# Altium schematic sheet main.SchDoc
size A2
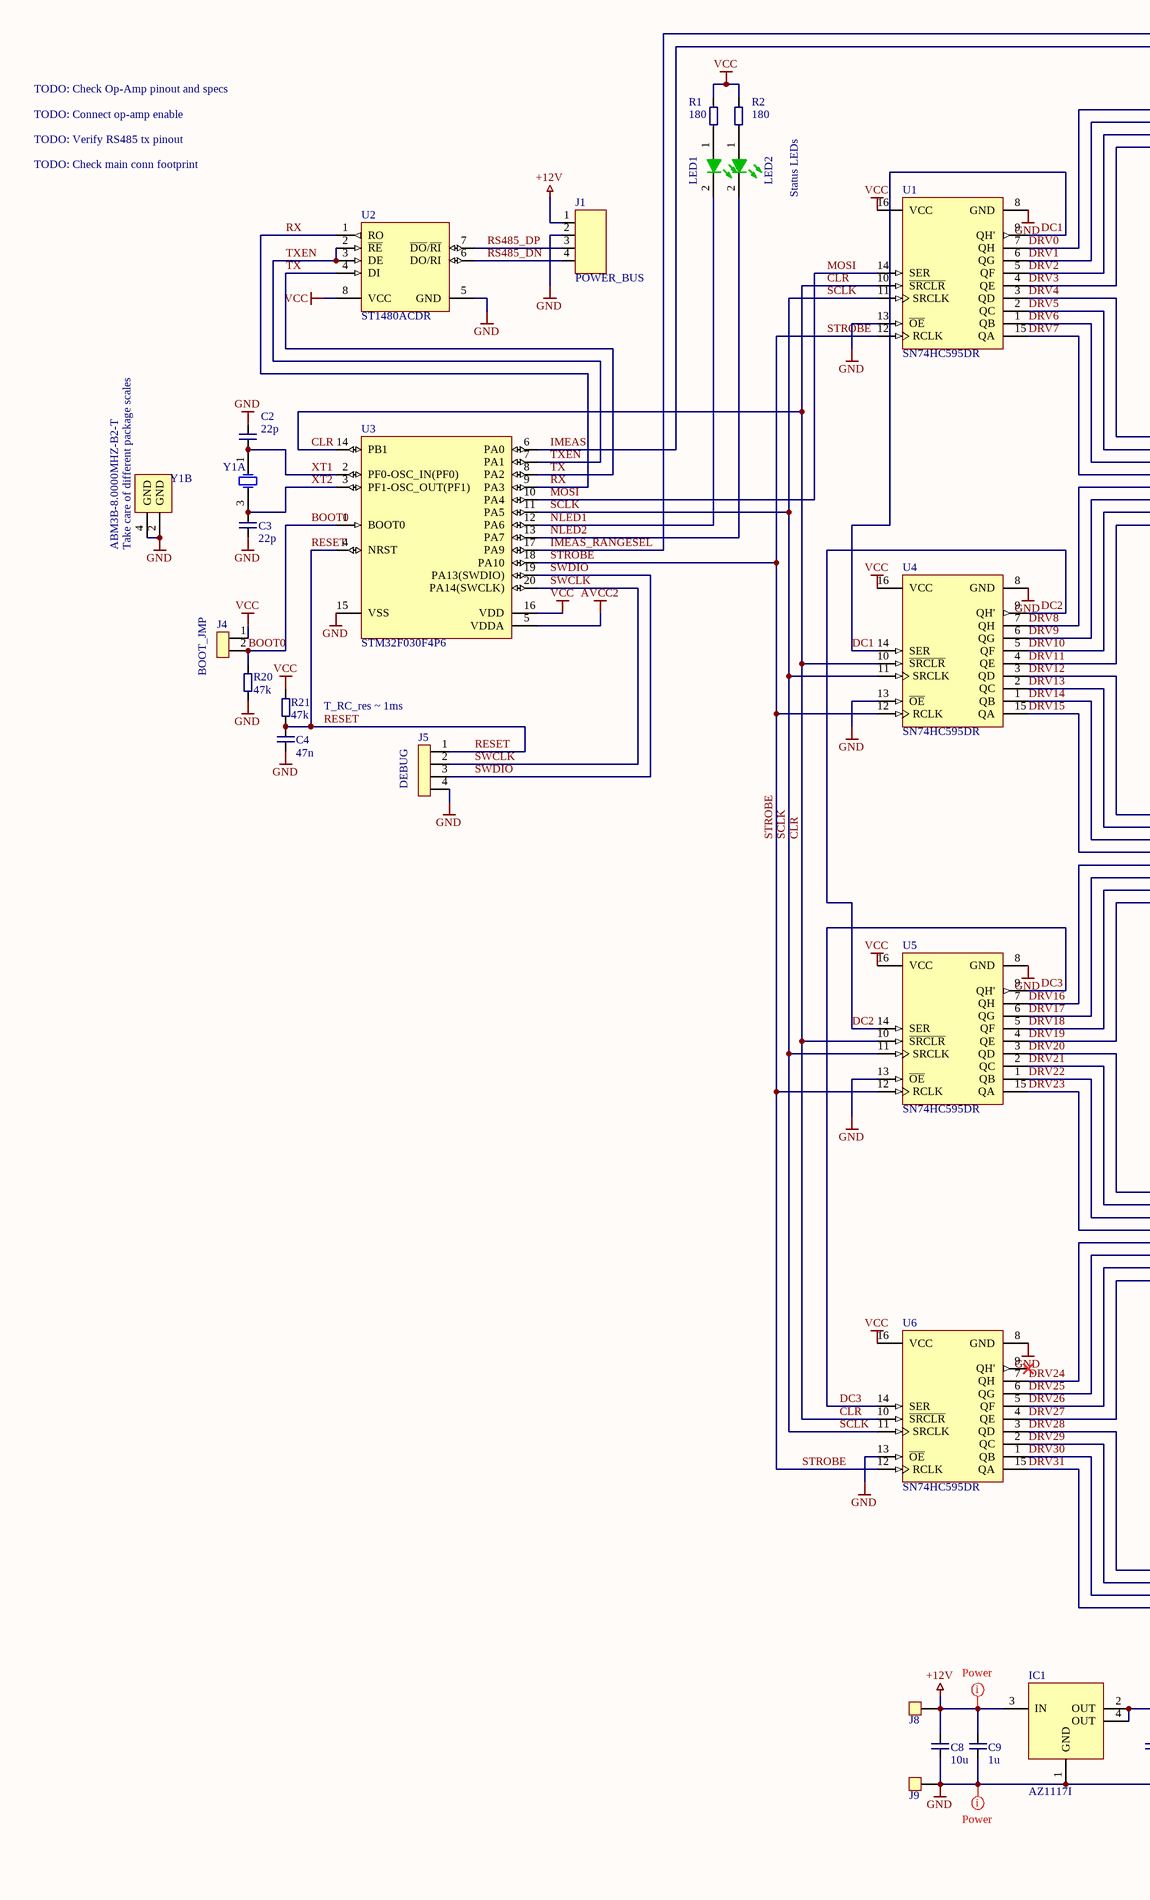
[diagram p0: main.SchDoc, left]
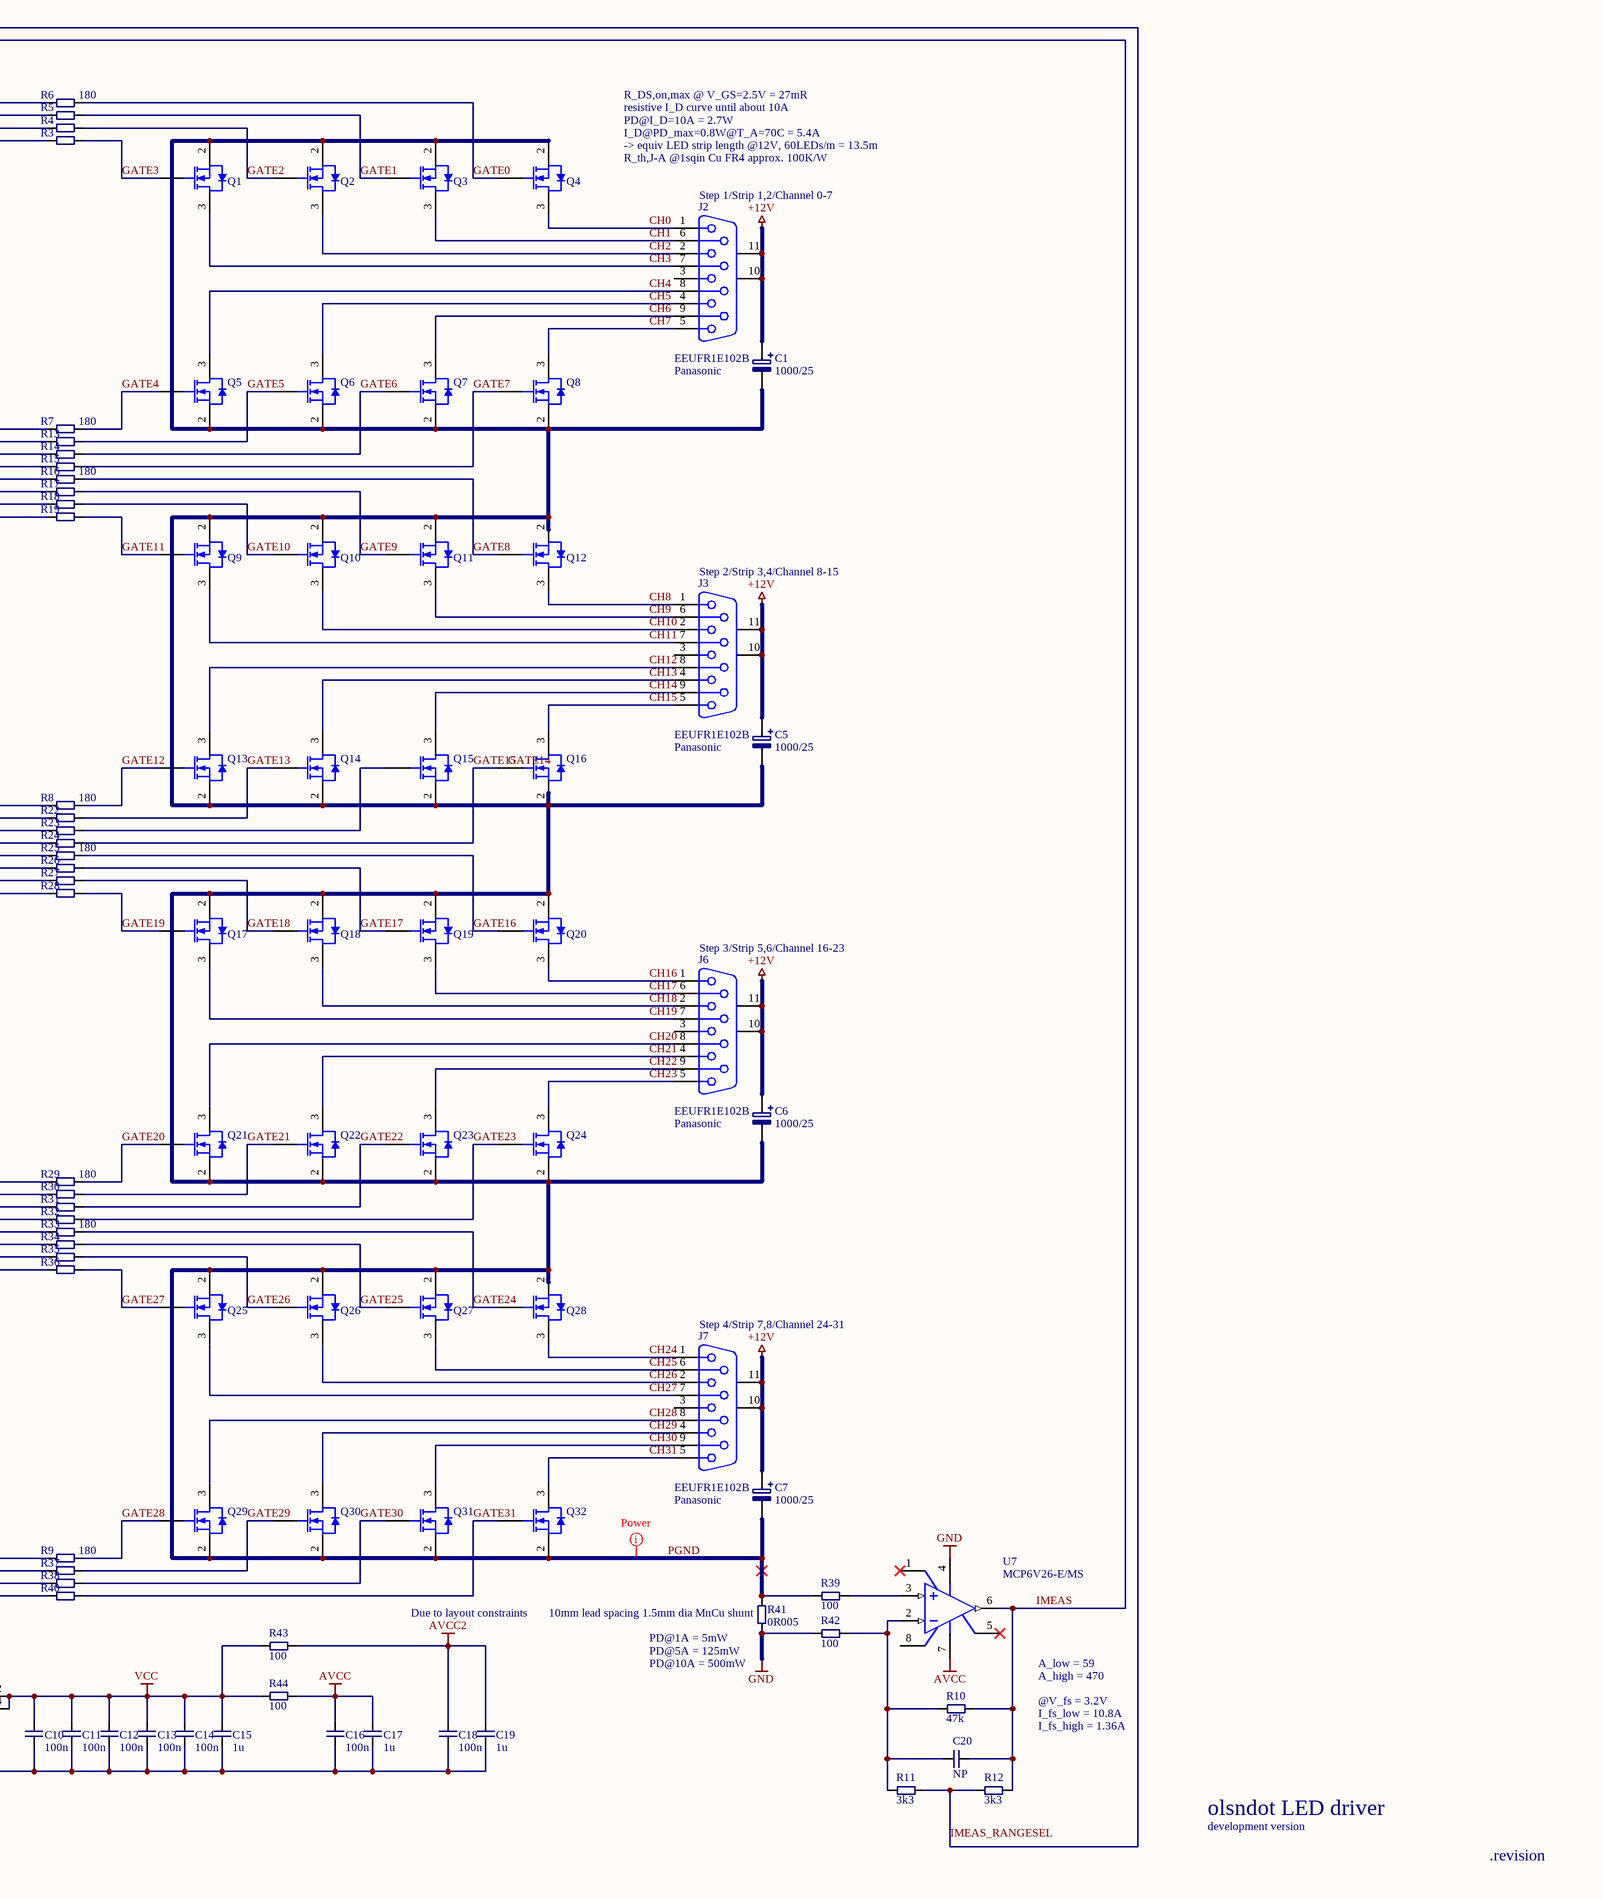
[diagram p1: main.SchDoc, right]

## Parts
C1  1000/25  Mfg Part No: EEUFR1E102B  Mfg: Panasonic  [ELKO_10mm_RM5]
C2  22p  [J1-0603]
C3  22p  [J1-0603]
C4  47n  [J1-0603]
C5  1000/25  Mfg Part No: EEUFR1E102B  Mfg: Panasonic  [ELKO_10mm_RM5]
C6  1000/25  Mfg Part No: EEUFR1E102B  Mfg: Panasonic  [ELKO_10mm_RM5]
C7  1000/25  Mfg Part No: EEUFR1E102B  Mfg: Panasonic  [ELKO_10mm_RM5]
C8  10u  [6-0805_M]
C9  1u  [6-0805_M]
C10  100n  [J1-0603]
C11  100n  [J1-0603]
C12  100n  [J1-0603]
C13  100n  [J1-0603]
C14  100n  [J1-0603]
C15  1u  [6-0805_M]
C16  100n  [J1-0603]
C17  1u  [6-0805_M]
C18  100n  [J1-0603]
C19  1u  [J1-0603]
C20  NP  [J1-0603]
IC1  AZ1117I  [SOT223_M]
J1  POWER_BUS  [TB_5.08_4P_FLANGE]
J2  Step 1/Strip 1,2/Channel 0-7  [DSUB1.385-2H9]
J3  Step 2/Strip 3,4/Channel 8-15  [DSUB1.385-2H9]
J4  BOOT_JMP  [JUMPER_2P]
J5  DEBUG  [PINHD_4x1_100mil]
J6  Step 3/Strip 5,6/Channel 16-23  [DSUB1.385-2H9]
J7  Step 4/Strip 7,8/Channel 24-31  [DSUB1.385-2H9]
J8  +12V  [FS-P_6.35]  (value not drawn)
J9  GND  [FS-P_6.35]  (value not drawn)
LED1  KP-1608MGC  [KING-0603LED_GREEN_V]  (value not drawn)
LED2  KP-1608MGC  [KING-0603LED_GREEN_V]  (value not drawn)
Q1  IRLML6244TRPbF  [ONSC-SOT-23-3-318-08_V]  (value not drawn)
Q2  IRLML6244TRPbF  [ONSC-SOT-23-3-318-08_V]  (value not drawn)
Q3  IRLML6244TRPbF  [ONSC-SOT-23-3-318-08_V]  (value not drawn)
Q4  IRLML6244TRPbF  [ONSC-SOT-23-3-318-08_V]  (value not drawn)
Q5  IRLML6244TRPbF  [ONSC-SOT-23-3-318-08_V]  (value not drawn)
Q6  IRLML6244TRPbF  [ONSC-SOT-23-3-318-08_V]  (value not drawn)
Q7  IRLML6244TRPbF  [ONSC-SOT-23-3-318-08_V]  (value not drawn)
Q8  IRLML6244TRPbF  [ONSC-SOT-23-3-318-08_V]  (value not drawn)
Q9  IRLML6244TRPbF  [ONSC-SOT-23-3-318-08_V]  (value not drawn)
Q10  IRLML6244TRPbF  [ONSC-SOT-23-3-318-08_V]  (value not drawn)
Q11  IRLML6244TRPbF  [ONSC-SOT-23-3-318-08_V]  (value not drawn)
Q12  IRLML6244TRPbF  [ONSC-SOT-23-3-318-08_V]  (value not drawn)
Q13  IRLML6244TRPbF  [ONSC-SOT-23-3-318-08_V]  (value not drawn)
Q14  IRLML6244TRPbF  [ONSC-SOT-23-3-318-08_V]  (value not drawn)
Q15  IRLML6244TRPbF  [ONSC-SOT-23-3-318-08_V]  (value not drawn)
Q16  IRLML6244TRPbF  [ONSC-SOT-23-3-318-08_V]  (value not drawn)
Q17  IRLML6244TRPbF  [ONSC-SOT-23-3-318-08_V]  (value not drawn)
Q18  IRLML6244TRPbF  [ONSC-SOT-23-3-318-08_V]  (value not drawn)
Q19  IRLML6244TRPbF  [ONSC-SOT-23-3-318-08_V]  (value not drawn)
Q20  IRLML6244TRPbF  [ONSC-SOT-23-3-318-08_V]  (value not drawn)
Q21  IRLML6244TRPbF  [ONSC-SOT-23-3-318-08_V]  (value not drawn)
Q22  IRLML6244TRPbF  [ONSC-SOT-23-3-318-08_V]  (value not drawn)
Q23  IRLML6244TRPbF  [ONSC-SOT-23-3-318-08_V]  (value not drawn)
Q24  IRLML6244TRPbF  [ONSC-SOT-23-3-318-08_V]  (value not drawn)
Q25  IRLML6244TRPbF  [ONSC-SOT-23-3-318-08_V]  (value not drawn)
Q26  IRLML6244TRPbF  [ONSC-SOT-23-3-318-08_V]  (value not drawn)
Q27  IRLML6244TRPbF  [ONSC-SOT-23-3-318-08_V]  (value not drawn)
Q28  IRLML6244TRPbF  [ONSC-SOT-23-3-318-08_V]  (value not drawn)
Q29  IRLML6244TRPbF  [ONSC-SOT-23-3-318-08_V]  (value not drawn)
Q30  IRLML6244TRPbF  [ONSC-SOT-23-3-318-08_V]  (value not drawn)
Q31  IRLML6244TRPbF  [ONSC-SOT-23-3-318-08_V]  (value not drawn)
Q32  IRLML6244TRPbF  [ONSC-SOT-23-3-318-08_V]  (value not drawn)
R1  180  [J1-0603]
R2  180  [J1-0603]
R3  180  [J1-0603]  (value not drawn)
R4  180  [J1-0603]  (value not drawn)
R5  180  [J1-0603]  (value not drawn)
R6  180  [J1-0603]
R7  180  [J1-0603]
R8  180  [J1-0603]
R9  180  [J1-0603]
R10  47k  [J1-0603]
R11  3k3  [J1-0603]
R12  3k3  [J1-0603]
R13  180  [J1-0603]  (value not drawn)
R14  180  [J1-0603]  (value not drawn)
R15  180  [J1-0603]  (value not drawn)
R16  180  [J1-0603]
R17  180  [J1-0603]  (value not drawn)
R18  180  [J1-0603]  (value not drawn)
R19  180  [J1-0603]  (value not drawn)
R20  47k  [J1-0603]
R21  47k  [J1-0603]
R22  180  [J1-0603]  (value not drawn)
R23  180  [J1-0603]  (value not drawn)
R24  180  [J1-0603]  (value not drawn)
R25  180  [J1-0603]
R26  180  [J1-0603]  (value not drawn)
R27  180  [J1-0603]  (value not drawn)
R28  180  [J1-0603]  (value not drawn)
R29  180  [J1-0603]
R30  180  [J1-0603]  (value not drawn)
R31  180  [J1-0603]  (value not drawn)
R32  180  [J1-0603]  (value not drawn)
R33  180  [J1-0603]
R34  180  [J1-0603]  (value not drawn)
R35  180  [J1-0603]  (value not drawn)
R36  180  [J1-0603]  (value not drawn)
R37  180  [J1-0603]  (value not drawn)
R38  180  [J1-0603]  (value not drawn)
R39  100  [J1-0603]
R40  180  [J1-0603]  (value not drawn)
R41  0R005  mechanical: 10mm lead spacing 1.5mm dia MnCu shunt  [10x1.5mm_Shunt]
R42  100  [J1-0603]
R43  100  [J1-0603]
R44  100  [J1-0603]
U1  SN74HC595DR  [D0016A_M]
U2  ST1480ACDR  [SO8_M]
U3  STM32F030F4P6  [STM-TSSOP20_L]
U4  SN74HC595DR  [D0016A_M]
U5  SN74HC595DR  [D0016A_M]
U6  SN74HC595DR  [D0016A_M]
U7  MCP6V26-E/MS  [MSOP-MS8_N]
Y1  ABM3B-8.0000MHZ-B2-T  [XTAL_MJ_5x3.2]  (value not drawn)  (parts A,B of 2)

## Nets
+12V: C1.1 C5.1 C6.1 C7.1 C8.1 C9.1 IC1.3(IN) J1.1 J2.10(MH1) J2.11(MH2) J3.10(MH1) J3.11(MH2) J6.10(MH1) J6.11(MH2) J7.10(MH1) J7.11(MH2) J8.1
AVCC: C16.1 C17.1 R44.2 U7.7(VDD)
AVCC2: C18.1 C19.1 R43.2 U3.5(VDDA)
GND: C2.1 C3.2 C4.2 C8.2 C9.2 C10.2 C11.2 C12.2 C13.2 C14.2 C15.2 C16.2 C17.2 C18.2 C19.2 IC1.1(GND) J1.2 J5.4 J9.1 R20.1 R41.2 R42.1 U1.8(GND) U1.13(~{OE}) U2.5(GND) U3.15(VSS) U4.8(GND) U4.13(~{OE}) U5.8(GND) U5.13(~{OE}) U6.8(GND) U6.13(~{OE}) U7.4(VSS) Y1.2(GND) Y1.4(GND)
VCC: C10.1 C11.1 C12.1 C13.1 C14.1 C15.1 IC1.2(OUT) IC1.4(OUT) J4.1 R1.2 R2.2 R21.2 R43.1 R44.1 U1.16(VCC) U2.8(VCC) U3.16(VDD) U4.16(VCC) U5.16(VCC) U6.16(VCC)
BOOT0: J4.2 R20.2 U3.1(BOOT0)
CH0: J2.1 Q4.3(D)
CH1: J2.6 Q3.3(D)
CH2: J2.2 Q2.3(D)
CH3: J2.7 Q1.3(D)
CH4: J2.8 Q5.3(D)
CH5: J2.4 Q6.3(D)
CH6: J2.9 Q7.3(D)
CH7: J2.5 Q8.3(D)
CH8: J3.1 Q12.3(D)
CH9: J3.6 Q11.3(D)
CH10: J3.2 Q10.3(D)
CH11: J3.7 Q9.3(D)
CH12: J3.8 Q13.3(D)
CH13: J3.4 Q14.3(D)
CH14: J3.9 Q15.3(D)
CH15: J3.5 Q16.3(D)
CH16: J6.1 Q20.3(D)
CH17: J6.6 Q19.3(D)
CH18: J6.2 Q18.3(D)
CH19: J6.7 Q17.3(D)
CH20: J6.8 Q21.3(D)
CH21: J6.4 Q22.3(D)
CH22: J6.9 Q23.3(D)
CH23: J6.5 Q24.3(D)
CH24: J7.1 Q28.3(D)
CH25: J7.6 Q27.3(D)
CH26: J7.2 Q26.3(D)
CH27: J7.7 Q25.3(D)
CH28: J7.8 Q29.3(D)
CH29: J7.4 Q30.3(D)
CH30: J7.9 Q31.3(D)
CH31: J7.5 Q32.3(D)
CLR: U1.10(~{SRCLR}) U3.14(PB1) U4.10(~{SRCLR}) U5.10(~{SRCLR}) U6.10(~{SRCLR})
DC1: U1.9(QH') U4.14(SER)
DC2: U4.9(QH') U5.14(SER)
DC3: U5.9(QH') U6.14(SER)
DRV0: R6.2 U1.7(QH)
DRV1: R5.2 U1.6(QG)
DRV2: R4.2 U1.5(QF)
DRV3: R3.2 U1.4(QE)
DRV4: R7.2 U1.3(QD)
DRV5: R13.2 U1.2(QC)
DRV6: R14.2 U1.1(QB)
DRV7: R15.2 U1.15(QA)
DRV8: R16.2 U4.7(QH)
DRV9: R17.2 U4.6(QG)
DRV10: R18.2 U4.5(QF)
DRV11: R19.2 U4.4(QE)
DRV12: R8.2 U4.3(QD)
DRV13: R22.2 U4.2(QC)
DRV14: R23.2 U4.1(QB)
DRV15: R24.2 U4.15(QA)
DRV16: R25.2 U5.7(QH)
DRV17: R26.2 U5.6(QG)
DRV18: R27.2 U5.5(QF)
DRV19: R28.2 U5.4(QE)
DRV20: R29.2 U5.3(QD)
DRV21: R30.2 U5.2(QC)
DRV22: R31.2 U5.1(QB)
DRV23: R32.2 U5.15(QA)
DRV24: R33.2 U6.7(QH)
DRV25: R34.2 U6.6(QG)
DRV26: R35.2 U6.5(QF)
DRV27: R36.2 U6.4(QE)
DRV28: R9.2 U6.3(QD)
DRV29: R37.2 U6.2(QC)
DRV30: R38.2 U6.1(QB)
DRV31: R40.2 U6.15(QA)
GATE0: Q4.1(G) R6.1
GATE1: Q3.1(G) R5.1
GATE2: Q2.1(G) R4.1
GATE3: Q1.1(G) R3.1
GATE4: Q5.1(G) R7.1
GATE5: Q6.1(G) R13.1
GATE6: Q7.1(G) R14.1
GATE7: Q8.1(G) R15.1
GATE8: Q12.1(G) R16.1
GATE9: Q11.1(G) R17.1
GATE10: Q10.1(G) R18.1
GATE11: Q9.1(G) R19.1
GATE12: Q13.1(G) R8.1
GATE13: Q14.1(G) R22.1
GATE15: Q16.1(G) R24.1
GATE16: Q20.1(G) R25.1
GATE17: Q19.1(G) R26.1
GATE18: Q18.1(G) R27.1
GATE19: Q17.1(G) R28.1
GATE20: Q21.1(G) R29.1
GATE21: Q22.1(G) R30.1
GATE22: Q23.1(G) R31.1
GATE23: Q24.1(G) R32.1
GATE24: Q28.1(G) R33.1
GATE25: Q27.1(G) R34.1
GATE26: Q26.1(G) R35.1
GATE27: Q25.1(G) R36.1
GATE28: Q29.1(G) R9.1
GATE29: Q30.1(G) R37.1
GATE30: Q31.1(G) R38.1
GATE31: Q32.1(G) R40.1
IMEAS: C20.2 R10.2 R12.2 U3.6(PA0) U7.6(VOUT)
IMEAS_RANGESEL: R11.2 R12.1 U3.17(PA9)
MOSI: U1.14(SER) U3.10(PA4)
NLED1: LED1.2(K) U3.12(PA6)
NLED2: LED2.2(K) U3.13(PA7)
PGND: C1.2 C5.2 C6.2 C7.2 Q1.2(S) Q2.2(S) Q3.2(S) Q4.2(S) Q5.2(S) Q6.2(S) Q7.2(S) Q8.2(S) Q9.2(S) Q10.2(S) Q11.2(S) Q12.2(S) Q13.2(S) Q14.2(S) Q15.2(S) Q16.2(S) Q17.2(S) Q18.2(S) Q19.2(S) Q20.2(S) Q21.2(S) Q22.2(S) Q23.2(S) Q24.2(S) Q25.2(S) Q26.2(S) Q27.2(S) Q28.2(S) Q29.2(S) Q30.2(S) Q31.2(S) Q32.2(S) R39.1 R41.1
RESET: C4.1 J5.1 R21.1 U3.4(NRST)
RS485_DN: J1.4 U2.6(DO/RI)
RS485_DP: J1.3 U2.7(~{DO}/~{RI})
RX: U2.1(RO) U3.9(PA3)
SCLK: U1.11(SRCLK) U3.11(PA5) U4.11(SRCLK) U5.11(SRCLK) U6.11(SRCLK)
STROBE: U1.12(RCLK) U3.18(PA10) U4.12(RCLK) U5.12(RCLK) U6.12(RCLK)
SWCLK: J5.2 U3.20(PA14(SWCLK))
SWDIO: J5.3 U3.19(PA13(SWDIO))
TX: U2.4(DI) U3.8(PA2)
TXEN: U2.2(~{RE}) U2.3(DE) U3.7(PA1)
XT1: C2.2 U3.2(PF0-OSC_IN(PF0)) Y1.1(X1)
XT2: C3.1 U3.3(PF1-OSC_OUT(PF1)) Y1.3(X2)
NetC20_1: C20.1 R10.1 R11.1 R42.2 U7.2(VIN-)
NetLED1_1: LED1.1(A) R1.1
NetLED2_1: LED2.1(A) R2.1
NetQ15_1: Q15.1(G) R23.1
NetR39_2: R39.2 U7.3(VIN+)

Not connected (* = marked no-connect by the designer): J2 3; J3 3; J6 3; J7 3; U6 9(QH')*; U7 1(NC)* 5(NC)* 8(NC)

## Layout directives
net class power: +12V, GND, PGND

## Notes on the sheet
- TODO: Verify RS485 tx pinout
- TODO: Check Op-Amp pinout and specs
- TODO: Connect op-amp enable
- R_DS,on,max @ V_GS=2.5V = 27mR
- resistive I_D curve until about 10A
- PD@I_D=10A = 2.7W
- I_D@PD_max=0.8W@T_A=70C = 5.4A
- TODO: Check main conn footprint
- Status LEDs
- -> equiv LED strip length @12V, 60LEDs/m = 13.5m
- R_th,J-A @1sqin Cu FR4 approx. 100K/W
- T_RC_res ~ 1ms
- Due to layout constraints
- PD@1A = 5mW
- (near R41) PD@5A = 125mW
- (near R41) PD@10A = 500mW
- A_low = 59
- A_high = 470
- @V_fs = 3.2V
- I_fs_low = 10.8A
- I_fs_high = 1.36A
- olsndot LED driver
- development version
- .revision
- Labels drawn without touching a wire or pin: GATE14

## Library data of the parts
C1 C5-C7 = ELKO
C2-C4 C8-C20 = C: Capacitor
IC1 = AZ1117I: LDO, industrial temp range
J1 = Phoenix_PT1,5/4-5,0H
J2 J3 J6 J7 = D Connector 9: Receptacle Assembly, 9 Position, Right Angle; PackageDocument: O; Positions: 9; Published: 15-Jun-2001; LatestRevisionDate: 17-Jul-2002; LatestRevisionNote: Re-released for DXP Platform.; DatasheetDocument: 1-Sep-1999; PackageReference: 788750; Publisher: Altium Limited; Orientation: Right Angle; Gender: Receptacle
J4 = JUMPER
J5 = PH_4x1: Pin Header 4x1 pin
J8 J9 = TESTPOINT
LED1 LED2 = CMP-0404-00001-1: LED, SMT, 0603(1608), 1.1mm thickness, Green; Manufacturer: Kingbright; Reverse Voltage: 5 V; Power Dissipation: 75 mW; Forward Current: 30 mA; Packing Type: 2000 pcs / reel; Mounting Technology: Surface Mount; Storage Temperature: -40 to +85 degC; ComponentLink1URL: http://www.kingbright.com/; PackageDescription: 2-Pin SMT LED, 1.6 x 0.8 mm Pitch; PartNumber: KP-1608MGC; PackageReference: 0603LED_GREEN; ComponentLink1Description: Manufacturer URL
Q1-Q32 = CMP-1058-00794-1: Power MOSFET, 500 mA, 60 V, N-Channel, 3-Pin SOT-23, Pb-Free, Tape and Reel; Manufacturer: On Semiconductor; PartNumber: NVBF170LT1G; ID Max (A): 0.5; V(BR)DSS Min (V): 60; Configuration: Single; Channel Polarity: N Channel; PD Max (W): 0.225; VGS(th) Max (V): 3; VGS Max (V): 20; ComponentLink3URL: http://www.onsemi.cn/pub_link/Collateral/318-08.PDF; Mounting Technology: Surface Mount; ComponentLink2URL: http://www.onsemi.cn/pub_link/Collateral/MMBF170LT1-D.PDF; RoHS: Pb-Free; ComponentLink2Description: Datasheet; ComponentLink1URL: http://www.onsemi.com/; Package Type: SOT-23-3; Packing: Tape and Reel; DatasheetVersion: Rev. 9; PackageDescription: 3-Pin Small Outline Transistor, Body 2.92 x 1.3 mm, Pitch 0.95 mm; PackageVersion: Rev. AP, 11/2009; ComponentLink3Description: Package Specification; ComponentLink1Description: Manufacturer URL; PackageReference: SOT-23-3-318-08
R1-R44 = R: Resistor
U1 U4-U6 = CMP-0780-00037-3: 8-Bit Shift Registers With 3-State Output Registers, D0016A, LARGE T&R; Manufacturer: Texas Instruments; Output Drive (IOL/IOH)(Max)(mA): 7.8/-7.8; Rating: Military; ICC @ Nom Voltage(Max)(mA): 0.08; VCC(Min)(V): 2; tpd @ Nom Voltage(Max)(ns): 34; 3-State Output: Yes; Output Type: CMOS; Voltage(Nom)(V): 6; F @ Nom Voltage(Max)(Mhz): 28; Technology Family: HC; Bits: 4; PackageReference: D0016A; Code_JEDEC: MS-012 variation AC; Generic Part Number: SN74HC595; Operating Temperature Range(C): -40 to 85; DatasheetVersion: SCLS041H; PackageVersion: http://www.ti.com/lit/ml/mpds178g/mpds178g.pdf; Input Type: CMOS; VCC(Max)(V): 6
U2 = IN-LNTX-DS75176B: Multipoint RS-485/RS-422 Transceiver, 8-pin Narrow SOIC; Manufacturer: National Semiconductor; PackageTopMarking: NSZXTT*DS751*76BM; CompType: Interface IC; PowerWise: N; PackageReference: M08A; RoHS: N; PackageVersion: revM, May-2009; PinCount: 8; DatasheetVersion: Jul-2004; PackageDescription: SOIC Narrow, 4.9 x 3.9 x 1.45mm, 8 Lead, 1.27mm Pitch; Code_JEDEC: MS-012-AA; Code_IPC: SOIC127P600-8
U3 = CMP-0304-00039-2: ARM Cortex-M0 32-bit MCU, 16 KB Flash, 4 KB Internal RAM, 15 I/Os, 20-pin TSSOP, -40 to 85 degC, Tube; I/Os (High Current): 15; FLASH Size (Prog) (kB): 16; Internal RAM Size (kB): 4; Supply Voltage(Vcc) min (V): 2.4; Operating Frequency(F) (Processor speed) (MHz): 48; ComponentLink2URL: http://www.st.com/st-web-ui/static/active/en/resource/technical/document/datasheet/DM00088500.pdf; Core: ARM Cortex-M0; ComponentLink2Description: Datasheet; PackageDescription: 20-Pin Thin Shrink Small Outline Package, 6.5 x 4.4 mm Body, 0.65 mm Pitch; Mounting Technology: Surface Mount; ComponentLink1URL: http://www.st.com/web/en/home.html; PackageVersion: Rev. 1, 11/2012; ComponentLink3Description: Package Specification; PartNumber: STM32F030F4P6; ComponentLink3URL: http://www.st.com/st-web-ui/static/active/en/resource/technical/document/datasheet/DM00065136.pdf; DatasheetVersion: Rev. 1; PackageReference: TSSOP20; ComponentLink1Description: Manufacturer URL; Packing: Tube
U7 = CMP-0187-00815-1: 620 Î¼A, 2 MHz Auto-Zeroed Op Amp, 8-Pin MSOP, Extended Temperature; ComponentLink3URL: http://www.microchip.com/stellent/groups/techpub_sg/documents/packagingspec/en012702.pdf; ComponentLink1Description: Manufacturer URL; PackageReference: MSOP-MS8; PackageDescription: 8-Lead Plastic Micro Small Outline Package (MS) [MSOP]; ComponentLink3Description: Package Specification; DatasheetVersion: revB, Aug-2011; ComponentLink2URL: http://ww1.microchip.com/downloads/en/DeviceDoc/25007B.pdf; ComponentLink2Description: Datasheet; PackageVersion: revBB, Aug-2009; ComponentLink1URL: http://www.microchip.com/
Y1 = ABRA-ABM3B-4: Crystal, SMD, 25.000000MHz Stab=50ppm 18.0pF; Manufacturer: Abracon; PartNumber: ABM3B-25.000MHZ-B2-T; Packing Type: Tape & Reel; Body Shape: Rectangular; Note: Take care of different package scales; Case Size: 5.0 x 3.2 mm; PackageDescription: 4-Pin SMT Crystal, 5.2 x 3.4 mm Body; ComponentLink2Description: Datasheet; Mounting Technology: Surface Mount; ComponentLink1URL: http://www.abracon.com/; PackageReference: ABM3B; DatasheetVersion: Apr-13; ComponentLink2URL: http://www.abracon.com/Resonators/abm3b.pdf; ComponentLink1Description: Manufacturer URL; Storage Temperature: -40 to 80 degC